# Altium schematic sheet interface_hall.SchDoc
size A; SheetNumber: 16
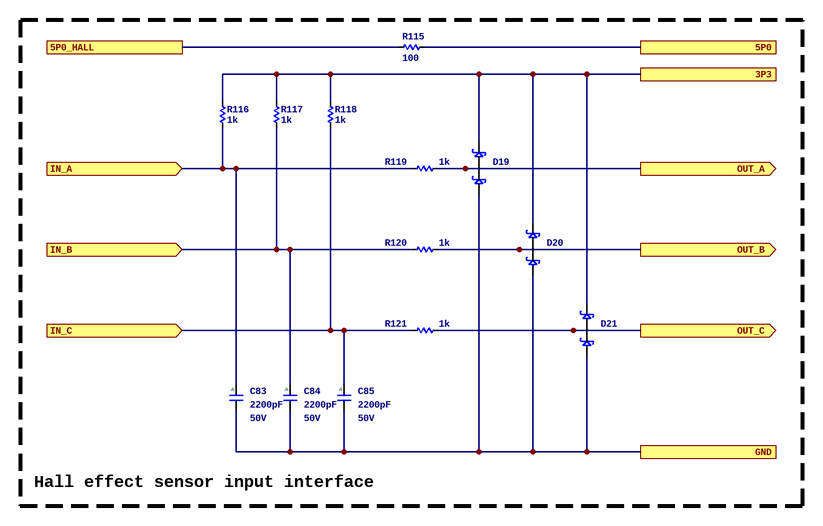
[diagram p0: interface_hall.SchDoc]

## Parts
C83  Capacitance: 2200pF  Voltage - Rated: 50V  [C0402_0.55MM]  (hidden comment: CGA2B2X7R1H222M050BA)
C84  Capacitance: 2200pF  Voltage - Rated: 50V  [C0402_0.55MM]  (hidden comment: CGA2B2X7R1H222M050BA)
C85  Capacitance: 2200pF  Voltage - Rated: 50V  [C0402_0.55MM]  (hidden comment: CGA2B2X7R1H222M050BA)
D19  BAT54SLT1G  [3SOT23]  (value not drawn)
D20  BAT54SLT1G  [3SOT23]  (value not drawn)
D21  BAT54SLT1G  [3SOT23]  (value not drawn)
R115  Resistance: 100  [R1206_0.70MM]  (hidden comment: ERJ-8ENF1000V)
R116  Resistance: 1k  [R0402_0.40MM]
R117  Resistance: 1k  [R0402_0.40MM]
R118  Resistance: 1k  [R0402_0.40MM]
R119  Resistance: 1k  [R0402_0.40MM]
R120  Resistance: 1k  [R0402_0.40MM]
R121  Resistance: 1k  [R0402_0.40MM]

## Blocks framed on the sheet
Hall effect sensor input interface: C83-C85 D19-D21 R115-R121

## Ports
3P3, 5P0, 5P0_HALL, GND, IN_A (in), IN_B (in), IN_C (in), OUT_A (out), OUT_B (out), OUT_C (out)

## Nets
3P3: D19.2 D20.2 D21.2 R116.1 R117.1 R118.1 ; port 3P3
5P0: R115.1 ; port 5P0
5P0_HALL: R115.2 ; port 5P0_HALL
GND: C83.2 C84.2 C85.2 D19.1 D20.1 D21.1 ; port GND
IN_A: C83.1 R116.2 R119.1 ; port IN_A
IN_B: C84.1 R117.2 R120.1 ; port IN_B
IN_C: C85.1 R118.2 R121.1 ; port IN_C
OUT_A: D19.3 R119.2 ; port OUT_A
OUT_B: D20.3 R120.2 ; port OUT_B
OUT_C: D21.3 R121.2 ; port OUT_C

## Notes on the sheet
- (in symbol CGA2B2X7R1H222M050BA) A

## Library data of the parts
C83-C85 = CGA2B2X7R1H222M050BA: CAP CER 2200PF 50V X7R 0402; Manufacturer: TDK Corporation; Unit Price (USD): 0.1; Tolerance: ±20%; ComponentLink1URL: https://product.tdk.com/info/en/catalog/datasheets/mlcc_automotive_general_en.pdf?ref_disty=digikey; ComponentLink1Description: Series Datasheet; Series: CGA; Part Status: Active; Temperature Coefficient: X7R; Operating Temperature: -55°C ~ 125°C; Applications: AEC-Q200; Mounting Type: Surface Mount, MLCC; Package / Case: 0402 (1005 Metric); Size / Dimension: 0.039" L x 0.020" W (1.00mm x 0.50mm); Thickness (Max): 0.022" (0.55mm); Supplier 1: Digikey; Supplier Part Number 1: 445-12274-1-ND; Manufacturer Part Number: CGA2B2X7R1H222M050BA
D19-D21 = SCHOTTKY_30V_DUAL_BAT54SLT1G: DIODE SCHOTTKY DUAL 30V SOT23; Manufacturer: ON Semiconductor; Supplier 1: Digikey; Manufacturer Part Number: BAT54SLT1G; RoHS: RoHS Compliant; ComponentLink1URL: https://www.onsemi.com/pdf/datasheet/bat54slt1-d.pdf; ComponentLink1Description: Datasheet; Supplier Part Number 1: BAT54SLT1GOSCT-ND; Supplier 2: LCSC; Supplier Part Number 2: C19726
R115 = ERJ-8ENF1000V: RES SMD 100 OHM 1% 1/4W 1206; Manufacturer: Panasonic Electronic Components; Unit Price (USD): 0.1; Power (Watts): 0.25W, 1/4W; Temperature Coefficient: ±100ppm/°C; ComponentLink1Description: Datasheet; ComponentLink1URL: https://industrial.panasonic.com/cdbs/www-data/pdf/RDA0000/AOA0000C304.pdf; Series: ERJ; Tolerance: ±1%; Composition: Thick Film; Features: Automotive AEC-Q200; Operating Temperature: -55°C ~ 155°C; Package / Case: 1206 (3216 Metric); Supplier Device Package: 1206; Size / Dimension: 0.126" L x 0.063" W (3.20mm x 1.60mm); Height - Seated (Max): 0.028" (0.70mm); Supplier 1: Digikey; Supplier Part Number 1: P100FCT-ND; Manufacturer Part Number: ERJ-8ENF1000V
R116-R121 = ERJ-2RKF1001X: RES SMD 1K OHM 1% 1/10W 0402; Manufacturer 1: Panasonic Electronic Components; Unit Price (USD): 0.1; Power (Watts): 0.1W, 1/10W; Temperature Coefficient: ±100ppm/°C; ComponentLink1Description: Datasheet; ComponentLink1URL: https://industrial.panasonic.com/cdbs/www-data/pdf/RDA0000/AOA0000C304.pdf; Series: ERJ; Tolerance: ±1%; Composition: Thick Film; Features: Automotive AEC-Q200; Operating Temperature: -55°C ~ 155°C; Package / Case: 0402 (1005 Metric); Supplier Device Package: 0402; Size / Dimension: 0.039" L x 0.020" W (1.00mm x 0.50mm); Height - Seated (Max): 0.016" (0.40mm); Manufacturer Part Number 1: ERJ-2RKF1001X; Supplier 1: Digikey; Supplier Part Number 1: P1.00KLCT-ND